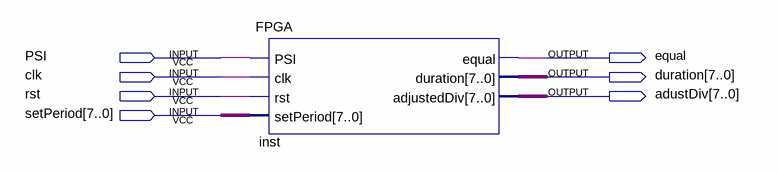
[diagram p0: schematic sheet]
// Quartus schematic Block1.bdf as structural Verilog: 1 symbols, 7 pins
module Block1 (
  input  PSI,
  input  clk,
  input  rst,
  input  [7:0] setPeriod,
  output equal,
  output [7:0] duration,
  output [7:0] adustDiv
);

  FPGA inst (
    .PSI(PSI), .clk(clk), .rst(rst), .setPeriod(setPeriod), .equal(equal), .duration(duration),
    .adjustedDiv(adustDiv));
endmodule
